# Altium schematic sheet ModulWRM1470.SchDoc: Радиомодуль NB-Fi
size 420 x 297 mm; CompanyName: Телематические решения; Address1: Address1; Address2: Address2; Address3: Address3; Address4: Address4; DocumentNumber: XXXX.012345.007Э3; SheetNumber: 1; SheetTotal: 1; Scale: 1:1; Title2str: WRM1470-r1.0; DocumentType: Схема электрическая принципиальная; FirstReferrence: АБВГ.123456.001
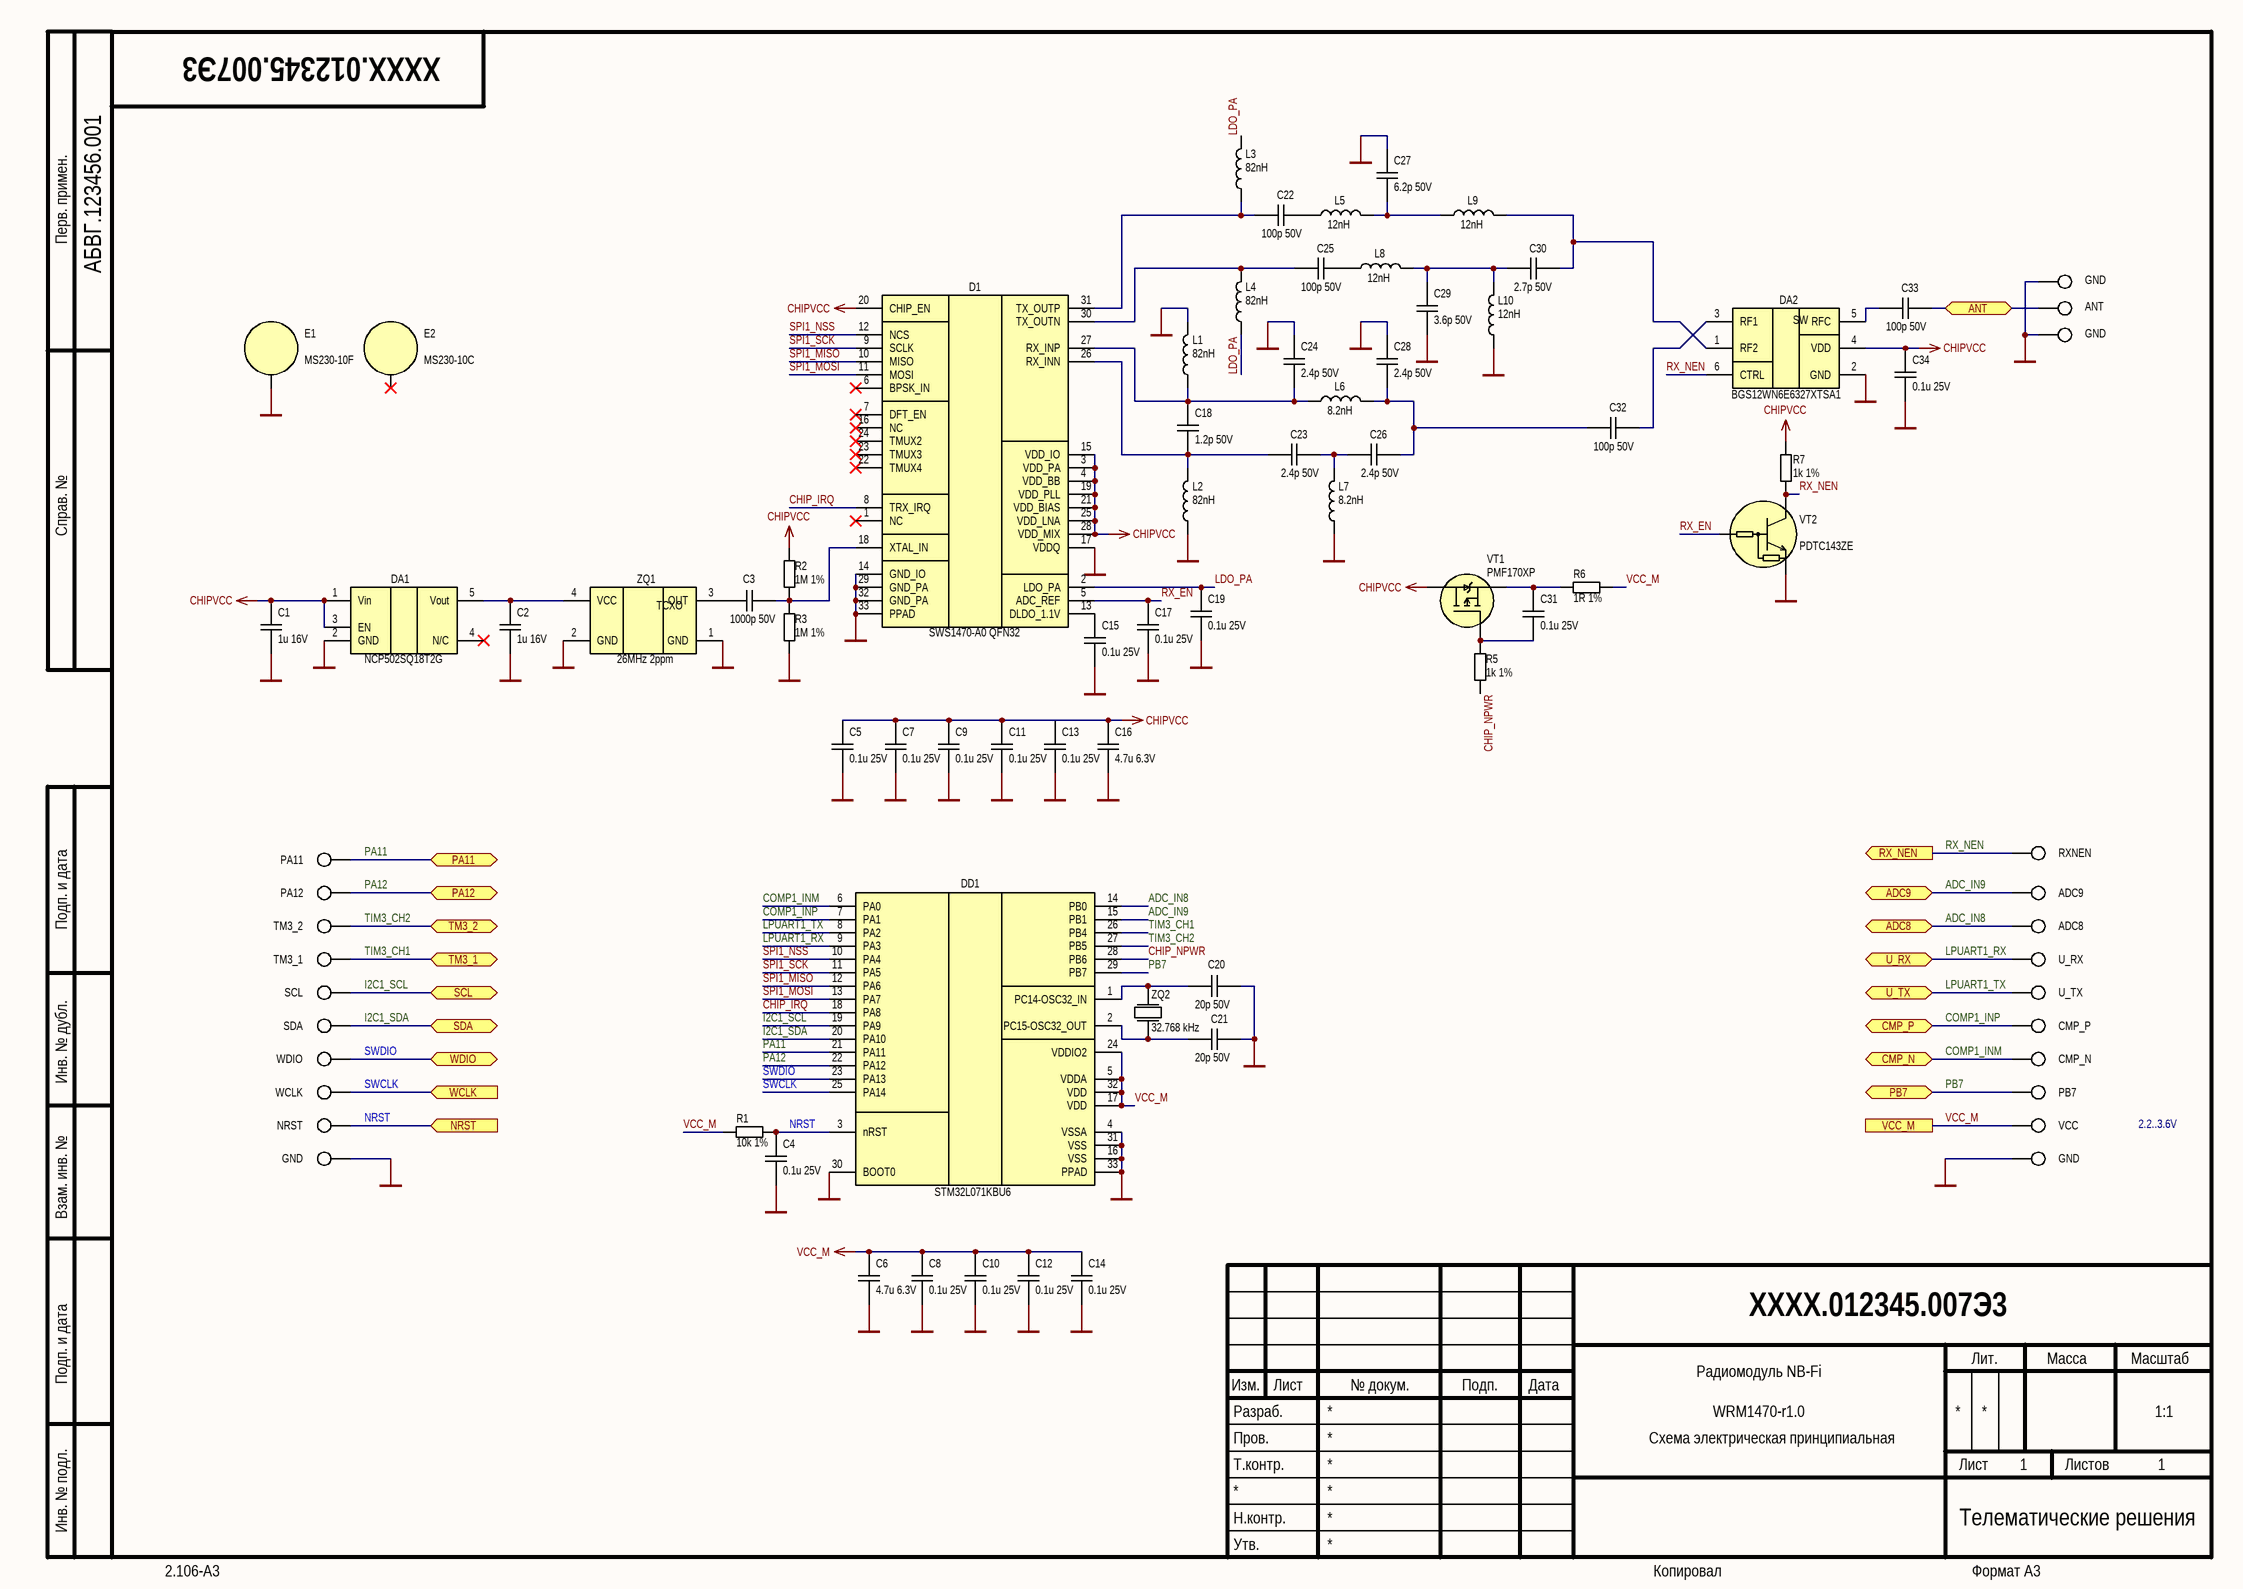
[diagram p0: ModulWRM1470.SchDoc]

## Parts
C1  1u 16V  [C0402]
C2  1u 16V  [C0402]
C3  1000p 50V  [C0402]
C4  0.1u 25V  [C0402]
C5  0.1u 25V  [C0402]
C6  4.7u 6.3V  [C0402]
C7  0.1u 25V  [C0402]
C8  0.1u 25V  [C0402]
C9  0.1u 25V  [C0402]
C10  0.1u 25V  [C0402]
C11  0.1u 25V  [C0402]
C12  0.1u 25V  [C0402]
C13  0.1u 25V  [C0402]
C14  0.1u 25V  [C0402]
C15  0.1u 25V  [C0402]
C16  4.7u 6.3V  [C0402]
C17  0.1u 25V  [C0402]
C18  1.2p 50V  [C0402]
C19  0.1u 25V  [C0402]
C20  20p 50V  [C0402]
C21  20p 50V  [C0402]
C22  100p 50V  [C0402]
C23  2.4p 50V  [C0402]
C24  2.4p 50V  [C0402]
C25  100p 50V  [C0402]
C26  2.4p 50V  [C0402]
C27  6.2p 50V  [C0402]
C28  2.4p 50V  [C0402]
C29  3.6p 50V  [C0402]
C30  2.7p 50V  [C0402]
C31  0.1u 25V  [C0402]
C32  100p 50V  [C0402]
C33  100p 50V  [C0402]
C34  0.1u 25V  [C0402]
D1  SWS1470-A0 QFN32  [QFN32]
DA1  NCP502SQ18T2G  [SOT323-5]
DA2  BGS12WN6E6327XTSA1  [6-XFDFN]
DD1  STM32L071KBU6  [UFQFPN32]
E1  MS230-10F  [MS230-10F]
E2  MS230-10C  [MS230-10C]
L1  82nH  [L0402_LQW]
L2  82nH  [L0402_LQW]
L3  82nH  [L0402_LQW]
L4  82nH  [L0402_LQW]
L5  12nH  [L0402_LQW]
L6  8.2nH  [L0402_LQW]
L7  8.2nH  [L0402_LQW]
L8  12nH  [L0402_LQW]
L9  12nH  [L0402_LQW]
L10  12nH  [L0402_LQW]
R1  10k 1%  [R0402]
R2  1M 1%  [R0402]
R3  1M 1%  [R0402]
R5  1k 1%  [R0402]
R6  1R 1%  [R0402]
R7  1k 1%  [R0402]
VT1  PMF170XP  [SOT323]
VT2  PDTC143ZE  [SOT416]
XT1  PA11  [PAD-d0.6-x1.1-y1.2]  (no BOM)
XT2  PA12  [PAD-d0.6-x1.1-y1.2]  (no BOM)
XT3  TM3_2  [PAD-d0.6-x1.1-y1.2]  (no BOM)
XT4  TM3_1  [PAD-d0.6-x1.1-y1.2]  (no BOM)
XT5  SCL  [PAD-d0.6-x1.1-y1.2]  (no BOM)
XT6  SDA  [PAD-d0.6-x1.1-y1.2]  (no BOM)
XT7  WDIO  [PAD-d0.6-x1.1-y1.2]  (no BOM)
XT8  WCLK  [PAD-d0.6-x1.1-y1.2]  (no BOM)
XT9  NRST  [PAD-d0.6-x1.1-y1.2]  (no BOM)
XT10  GND  [PAD-d0.6-x1.1-y1.2]  (no BOM)
XT11  GND  [PAD-d0.6-x1.1-y1.2]  (no BOM)
XT12  VCC  [PAD-d0.6-x1.1-y1.2]  (no BOM)
XT13  PB7  [PAD-d0.6-x1.1-y1.2]  (no BOM)
XT14  CMP_N  [PAD-d0.6-x1.1-y1.2]  (no BOM)
XT15  CMP_P  [PAD-d0.6-x1.1-y1.2]  (no BOM)
XT16  U_TX  [PAD-d0.6-x1.1-y1.2]  (no BOM)
XT17  U_RX  [PAD-d0.6-x1.1-y1.2]  (no BOM)
XT18  ADC8  [PAD-d0.6-x1.1-y1.2]  (no BOM)
XT19  ADC9  [PAD-d0.6-x1.1-y1.2]  (no BOM)
XT20  RXNEN  [PAD-d0.6-x1.1-y1.2]  (no BOM)
XT21  GND  [PAD-d0.6-x1.1-y1.2]  (no BOM)
XT22  ANT  [PAD-d0.6-x1.1-y1.2]  (no BOM)
XT23  GND  [PAD-d0.6-x1.1-y1.2]  (no BOM)
ZQ1  26MHz 2ppm  [QSMD2.0x1.6x0.7]
ZQ2  32.768 kHz  [QSMD3.2X1.5X0.8]

## Ports
ADC8 (bidir), ADC9 (bidir), ANT (bidir), CMP_N (bidir), CMP_P (bidir), NRST (in), PA11 (bidir), PA12 (bidir), PB7 (bidir), RX_NEN (out), SCL (bidir), SDA (bidir), TM3_1 (bidir), TM3_2 (bidir), U_RX (bidir), U_TX (bidir), VCC_M, WCLK (in), WDIO (bidir)

## Nets
CHIPVCC: C1.2 C5.2 C7.2 C9.2 C11.2 C13.2 C16.2 C34.2 D1.3(VDD_PA) D1.4(VDD_BB) D1.15(VDD_IO) D1.19(VDD_PLL) D1.20(CHIP_EN) D1.21(VDD_BIAS) D1.25(VDD_LNA) D1.28(VDD_MIX) DA1.1(Vin) DA1.3(EN) DA2.4(VDD) R2.2 R7.2 VT1.3(D)
GND: C1.1 C2.1 C4.2 C5.1 C6.2 C7.1 C8.2 C9.1 C10.2 C11.1 C12.2 C13.1 C14.2 C15.1 C16.1 C17.1 C19.1 C20.2 C21.2 C24.1 C27.1 C28.1 C29.2 C34.1 D1.14(GND_IO) D1.17(VDDQ) D1.29(GND_PA) D1.32(GND_PA) D1.33(PPAD) DA1.2(GND) DA2.2(GND) DD1.4(VSSA) DD1.16(VSS) DD1.30(BOOT0) DD1.31(VSS) DD1.33(PPAD) E1.1(SHIELD) L1.2 L2.1 L7.1 L10.1 R3.1 VT2.2 XT10.1 XT11.1 XT21.1 XT23.1 ZQ1.1(GND) ZQ1.2(GND)
VCC_M: C6.1 C8.1 C10.1 C12.1 C14.1 DD1.5(VDDA) DD1.17(VDD) DD1.24(VDDIO2) DD1.32(VDD) R1.1 R6.1 XT12.1 ; port VCC_M
ADC_IN8: DD1.14(PB0) XT18.1 ; port ADC8
ADC_IN9: DD1.15(PB1) XT19.1 ; port ADC9
ANT: C33.2 XT22.1 ; port ANT
CHIP_IRQ: D1.8(TRX_IRQ) DD1.18(PA8)
CHIP_NPWR: DD1.28(PB6) R5.1
COMP1_INM: DD1.6(PA0) XT14.1 ; port CMP_N
COMP1_INP: DD1.7(PA1) XT15.1 ; port CMP_P
I2C1_SCL: DD1.19(PA9) XT5.1 ; port SCL
I2C1_SDA: DD1.20(PA10) XT6.1 ; port SDA
LDO_PA: C19.2 D1.2(LDO_PA) L3.2 L4.1
LPUART1_RX: DD1.9(PA3) XT17.1 ; port U_RX
LPUART1_TX: DD1.8(PA2) XT16.1 ; port U_TX
NRST: C4.1 DD1.3(nRST) R1.2 XT9.1 ; port NRST
PA11: DD1.21(PA11) XT1.1 ; port PA11
PA12: DD1.22(PA12) XT2.1 ; port PA12
PB7: DD1.29(PB7) XT13.1 ; port PB7
RX_EN: C17.2 D1.5(ADC_REF) VT2.1
RX_NEN: DA2.6(CTRL) R7.1 VT2.3 XT20.1 ; port RX_NEN
SPI1_MISO: D1.10(MISO) DD1.12(PA6)
SPI1_MOSI: D1.11(MOSI) DD1.13(PA7)
SPI1_NSS: D1.12(NCS) DD1.10(PA4)
SPI1_SCK: D1.9(SCLK) DD1.11(PA5)
SWCLK: DD1.25(PA14) XT8.1 ; port WCLK
SWDIO: DD1.23(PA13) XT7.1 ; port WDIO
TIM3_CH1: DD1.26(PB4) XT4.1 ; port TM3_1
TIM3_CH2: DD1.27(PB5) XT3.1 ; port TM3_2
NetC2_2: C2.2 DA1.5(Vout) ZQ1.4(VCC)
NetC3_1: C3.1 ZQ1.3(OUT)
NetC3_2: C3.2 D1.18(XTAL_IN) R2.1 R3.2
NetC15_2: C15.2 D1.13(DLDO_1.1V)
NetC18_1: C18.1 C24.2 D1.27(RX_INP) L1.1 L6.1
NetC18_2: C18.2 C23.1 D1.26(RX_INN) L2.2
NetC20_1: C20.1 DD1.1(PC14-OSC32_IN) ZQ2.1
NetC21_1: C21.1 DD1.2(PC15-OSC32_OUT) ZQ2.3
NetC22_1: C22.1 D1.31(TX_OUTP) L3.1
NetC22_2: C22.2 L5.1
NetC23_2: C23.2 C26.1 L7.2
NetC25_1: C25.1 D1.30(TX_OUTN) L4.2
NetC25_2: C25.2 L8.1
NetC26_2: C26.2 C28.2 C32.1 L6.2
NetC27_2: C27.2 L5.2 L9.1
NetC29_1: C29.1 C30.1 L8.2 L10.2
NetC30_2: C30.2 DA2.1(RF2) L9.2
NetC31_1: C31.1 R5.2 VT1.1(G)
NetC31_2: C31.2 R6.2 VT1.2(S)
NetC32_2: C32.2 DA2.3(RF1)
NetC33_1: C33.1 DA2.5(RFC)

Not connected (* = marked no-connect by the designer): D1 1(NC)* 6(BPSK_IN)* 7(DFT_EN)* 16(NC)* 22(TMUX4)* 23(TMUX3)* 24(TMUX2)*; DA1 4(N/C)*; E2 1(SHIELD)*

## Notes on the sheet
- 2.2..3.6V
- Перв. примен.
- Справ. №
- Подп. и дата
- Инв. № дубл.
- Взам. инв. №
- Разраб.
- Изм.
- Лист
- № докум.
- Подп.
- Дата
- Лит.
- Масса
- Масштаб
- Пров.
- Т.контр.
- Листов
- Инв. № подл.
- Утв.
- Н.контр.
- 2.106-A3
- Копировал
- Формат А3
- (in symbol BGS12WN6E6327XTSA1) SW
- (in symbol NT2016SA-26.000000MHZ-NBG2) TCXO

## Library data of the parts
C1 C2 = CC0402KRX5R7BB105: CAP CER 1UF 16V X5R 0402; PartNumber: CC0402KRX5R7BB105
C3 = CC0402JRX7R9BB102: CAP CER 1000PF 50V X7R 0402; PartNumber: CC0402JRX7R9BB102
C4 C5 C7-C15 C17 C19 C31 C34 = CC0402KRX7R8BB104: CAP CER 0.1UF 25V X7R 0402; PartNumber: CC0402KRX7R8BB104
C6 C16 = CC0402KRX5R5BB475: CAP CER 4.7UF 6.3V X5R 0402; PartNumber: CC0402KRX5R5BB475
C18 = CC0402BRNPO9BN1R2: CAP CER 1.2PF 50V C0G/NPO 0402; PartNumber: CC0402BRNPO9BN1R2
C20 C21 = CC0402JRNPO9BN200: CAP CER 20PF 50V C0G/NPO 0402; PartNumber: CC0402JRNPO9BN200
C22 C25 C32 C33 = CC0402JRNPO9BN101: CAP CER 100PF 50V C0G/NPO 0402; PartNumber: CC0402JRNPO9BN101
C23 C24 C26 C28 = CC0402BRNPO9BN2R4: CAP CER 2.4PF 50V NPO 0402; PartNumber: CC0402BRNPO9BN2R4
C27 = CC0402CRNPO9BN6R2: CAP CER 6.2PF 50V NPO 0402; PartNumber: CC0402CRNPO9BN6R2
C29 = CC0402BRNPO9BN3R6: CAP CER 3.6PF 50V NPO 0402; PartNumber: CC0402BRNPO9BN3R6
C30 = CC0402BRNPO9BN2R7: CAP CER 2.7PF 50V C0G/NPO 0402; PartNumber: CC0402BRNPO9BN2R7
D1 = SWS1470-A0 QFN32: Waviot NB-Fi RF Transceiver QFN32; PartNumber: SWS1470-A0 QFN32
DA1 = NCP502SQ18T2G: IC REG LINEAR 1.8V 80MA SC88A; PartNumber: NCP502SQ18T2G
DA2 = BGS12WN6E6327XTSA1: RF Switch IC WLAN SPDT 50Ohm PG-TSNP-6-10; PartNumber: BGS12WN6E6327XTSA1
DD1 = STM32L071KBU6: ARM® Cortex®-M0+ STM32L0 Microcontroller IC 32-Bit 32MHz 128KB (128K x 8) FLASH 32-UFQFPN (5x5); PartNumber: STM32L071KBU6
E1 = MS230-10F: RF SHLD FRAME 0.461"X0.906" SLDR; PartNumber: MS230-10F
E2 = MS230-10C: RF SHIELD 0.461"X0.906" SNAP FIT; PartNumber: MS230-10C
L1-L4 = LQW15AN82NG00D: FIXED IND 82NH 130MA 2.24 OHM; PartNumber: LQW15AN82NG00D
L5 L8-L10 = LQW15AN12NG00D: FIXED IND 12NH 500MA 140 MOHM; PartNumber: LQW15AN12NG00D
L6 L7 = LQW15AN8N2G00D: FIXED IND 8.2NH 540MA 140 MOHM; PartNumber: LQW15AN8N2G00D
R1 = RC0402FR-0710KL: RES SMD 10K OHM 1% 1/16W 0402; PartNumber: RC0402FR-0710KL
R2 R3 = RC0402FR-071ML: RES SMD 1M OHM 1% 1/16W 0402; PartNumber: RC0402FR-071ML
R5 R7 = RC0402FR-071KL: RES SMD 1K OHM 1% 1/16W 0402; PartNumber: RC0402FR-071KL
R6 = RC0402FR-071RL: RES SMD 1 OHM 1% 1/16W 0402; PartNumber: RC0402FR-071RL
VT1 = PMF170XP: MOSFET P-CH 20V 1A SOT323; PartNumber: PMF170XP
VT2 = PDTC143ZE: SMALL SIGNAL BIPOLAR TRANSISTOR; PartNumber: PDTC143ZE
XT1-XT23 = PIN
ZQ1 = NT2016SA-26.000000MHZ-NBG2: TCXO Oscillator 4-pin; PartNumber: NT2016SA-26.000000MHZ-NBG2
ZQ2 = NX3215SA-32.768K-EXS00A: CRYSTAL 32.768KHZ 12.5PF SMD; PartNumber: NX3215SA-32.768K-EXS00A